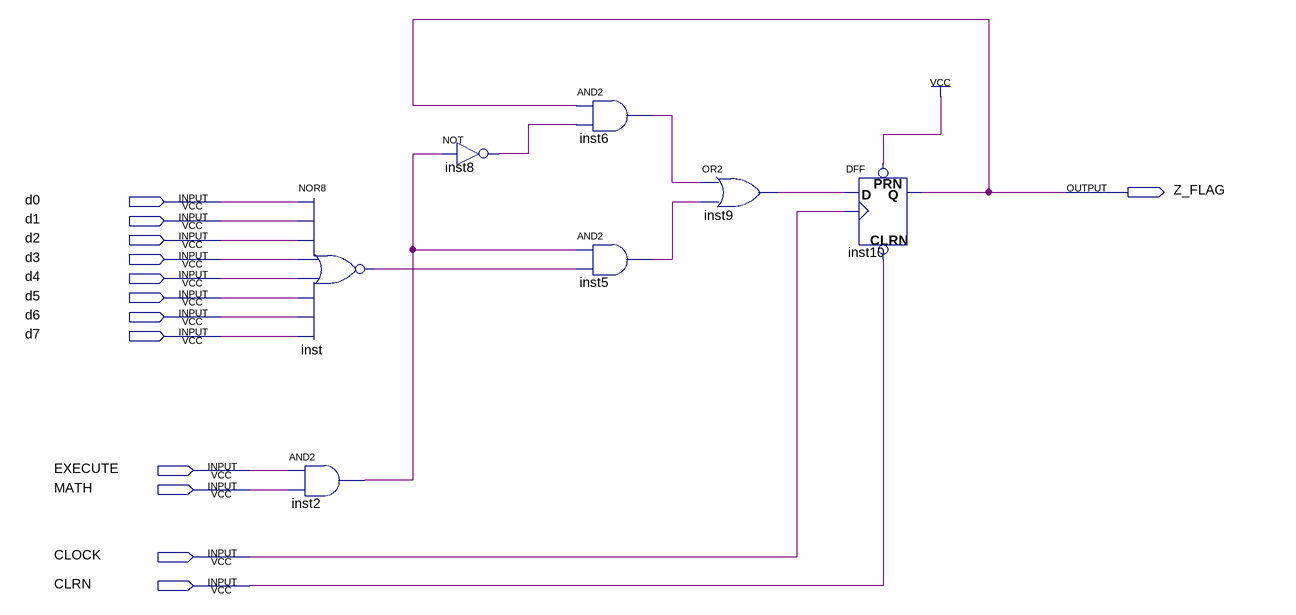
[diagram p0: schematic sheet]
// Quartus schematic Z_LOGIC.bdf as structural Verilog: 7 symbols, 13 pins
module Z_LOGIC (
  input  d0,
  input  d1,
  input  d2,
  input  d3,
  input  d4,
  input  d5,
  input  d6,
  input  d7,
  input  EXECUTE,
  input  MATH,
  input  CLOCK,
  input  CLRN,
  output Z_FLAG
);

  wire inst2_out, inst5_out, inst6_out, inst8_out, inst9_out, inst_out;

  nor inst (inst_out, d0, d1, d2, d3, d4, d5, d6, d7);
  and inst2 (inst2_out, EXECUTE, MATH);
  not inst8 (inst8_out, inst2_out);
  and inst6 (inst6_out, Z_FLAG, inst8_out);
  and inst5 (inst5_out, inst2_out, inst_out);
  or inst9 (inst9_out, inst6_out, inst5_out);
  DFF inst10 (.CLRN(CLRN), .CLK(CLOCK), .D(inst9_out), .PRN(1'b1), .Q(Z_FLAG));
endmodule
